# Altium schematic sheet Zigbee_broad.SchDoc
size A4
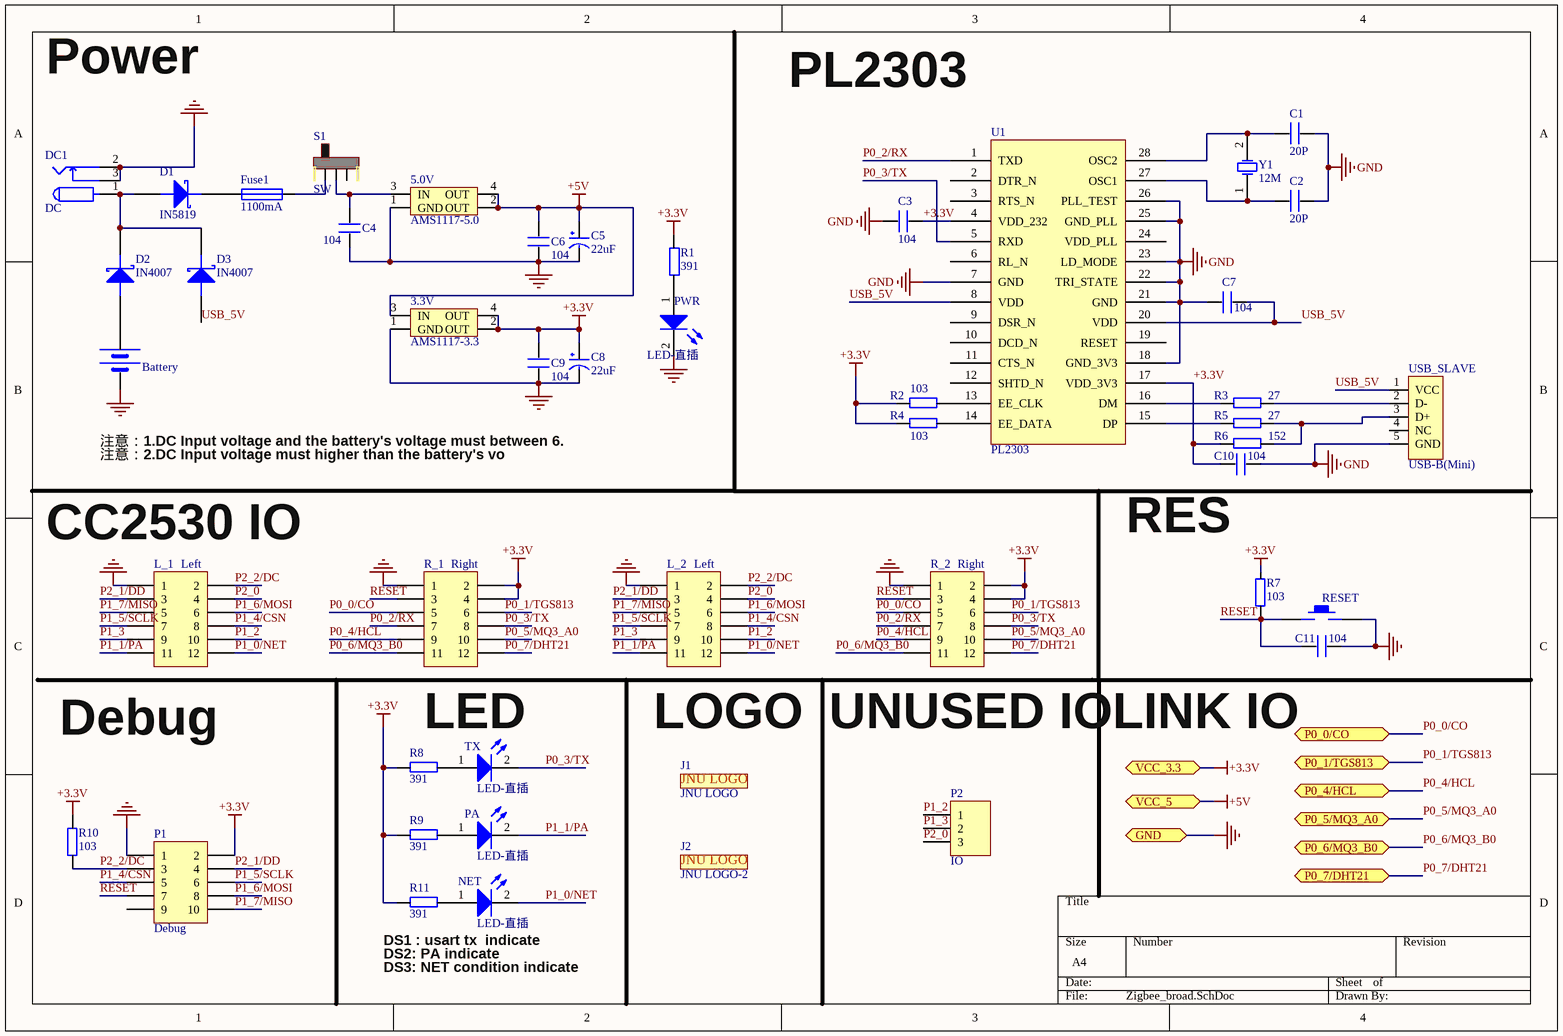
[diagram p0: Zigbee_broad.SchDoc]

## Parts
3.3V  AMS1117-3.3  [AMS1117]
5.0V  AMS1117-5.0  [AMS1117]
Battery  BATT  [DC]  (value not drawn)
C1  20P  [0603]
C2  20P  [0603]
C3  104  [0603]
C4  104  [0603]
C5  22uF  [Cap2]
C6  104  [0603]
C7  104  [0603]
C8  22uF  [Cap2]
C9  104  [0603]
C10  104  [0603]
C11  104  [0603]
D1  IN5819  [IN4007 M7]
D2  IN4007  [IN4007 M7]
D3  IN4007  [IN4007 M7]
DC1  DC  [DC]
Fuse1  1100mA  [1812]
J1  JNU LOGO  [JNU LOGO - 1]
J2  JNU LOGO-2  [JNU LOGO - 1]
L_1  Left  [HDR2X6]
L_2  Left  [HDR2X6]
NET  LED-直插  [LED]
P1  Debug  [Header 2*5]
P2  IO  [HDR1X3]
PA  LED-直插  [LED]
PWR  LED-直插  [LED]
R1  391  [0603]
R2  103  [0603]
R3  27  [0603]
R4  103  [0603]
R5  27  [0603]
R6  152  [0603]
R7  103  [0603]
R8  391  [0603]
R9  391  [0603]
R10  103  [0603]
R11  391  [0603]
R_1  Right  [HDR2X6]
R_2  Right  [HDR2X6]
RESET  KEY_M  [KEY_M]  (value not drawn)
S1  SW  [switch]
TX  LED-直插  [LED]
U1  PL2303  [PL2303 -SOP28N]
USB_SLAVE  USB-B(Mini)  [MINI_USB - 1]
Y1  12M  [XTAL]

## Ports
GND, P0_0/CO, P0_1/TGS813, P0_4/HCL, P0_5/MQ3_A0, P0_6/MQ3_B0, P0_7/DHT21, VCC_3.3, VCC_5

## Nets
+3.3V: 3.3V.2(OUT) 3.3V.4(OUT) C3.1 C8.1(VCC) C9.2 C10.2 P1.2 R1.2 R2.2 R4.2 R6.2 R7.1 R8.2 R9.2 R10.1 R11.2 R_1.2 R_1.4 R_2.2 R_2.4 U1.4(VDD_232) U1.17(VDD_3V3) ; port VCC_3.3
+5V: 3.3V.3(IN) 5.0V.2(OUT) 5.0V.4(OUT) C5.1(VCC) C6.2 ; port VCC_5
GND: 3.3V.1(GND) 5.0V.1(GND) Battery.2(GND) C1.1 C2.1 C3.2 C4.1 C5.2(GND) C6.1 C7.2 C8.2(GND) C9.1 C10.1 C11.1 DC1.2 DC1.3 L_1.1 L_2.1 P1.1 PWR.2 R_1.1 R_2.1 RESET.2 U1.7(GND) U1.18(GND_3V3) U1.21(GND) U1.22(TRI_STATE) U1.23(LD_MODE) U1.25(GND_PLL) U1.26(PLL_TEST) USB_SLAVE.5(GND) ; port GND
P0_0/CO: R_1.5 R_2.5 ; port P0_0/CO
P0_1/TGS813: R_1.6 R_2.6 ; port P0_1/TGS813
P0_2/RX: R_1.7 R_2.7 U1.1(TXD)
P0_3/TX: R_1.8 R_2.8 TX.2 U1.5(RXD)
P0_4/HCL: R_1.9 R_2.9 ; port P0_4/HCL
P0_5/MQ3_A0: R_1.10 R_2.10 ; port P0_5/MQ3_A0
P0_6/MQ3_B0: R_1.11 R_2.11 ; port P0_6/MQ3_B0
P0_7/DHT21: R_1.12 R_2.12 ; port P0_7/DHT21
P1_0/NET: L_1.12 L_2.12 NET.2
P1_1/PA: L_1.11 L_2.11 PA.2
P1_2: L_1.10 L_2.10 P2.1
P1_3: L_1.9 L_2.9 P2.2
P1_4/CSN: L_1.8 L_2.8 P1.5
P1_5/SCLK: L_1.7 L_2.7 P1.6
P1_6/MOSI: L_1.6 L_2.6 P1.8
P1_7/MISO: L_1.5 L_2.5 P1.10
P2_0: L_1.4 L_2.4 P2.3
P2_1/DD: L_1.3 L_2.3 P1.4
P2_2/DC: L_1.2 L_2.2 P1.3 R10.2
RESET: C11.2 P1.7 R7.2 R_1.3 R_2.3 RESET.1
USB_5V: C7.1 D3.1 U1.8(VDD) U1.20(VDD) USB_SLAVE.1(VCC)
Net5.0V_3: 5.0V.3(IN) C4.2 S1.2
NetBattery_1: Battery.1(VCC) D2.1
NetC1_2: C1.2 U1.28(OSC2) Y1.2(OSC2)
NetC2_2: C2.2 U1.27(OSC1) Y1.1(OSC1)
NetD1_1: D1.1 D2.2 D3.2 DC1.1
NetD1_2: D1.2 Fuse1.1
NetFuse1_2: Fuse1.2 S1.1
NetNET_1: NET.1 R11.1
NetPA_1: PA.1 R9.1
NetPWR_1: PWR.1 R1.1
NetR2_1: R2.1 U1.13(EE_CLK)
NetR3_1: R3.1 USB_SLAVE.2(D-)
NetR3_2: R3.2 U1.16(DM)
NetR4_1: R4.1 U1.14(EE_DATA)
NetR5_1: R5.1 R6.1 USB_SLAVE.3(D+)
NetR5_2: R5.2 U1.15(DP)
NetR8_1: R8.1 TX.1

Not connected (* = marked no-connect by the designer): P1 9; S1 3; U1 2(DTR_N) 3(RTS_N) 6(RL_N) 9(DSR_N) 10(DCD_N) 11(CTS_N) 12(SHTD_N) 19(RESET) 24(VDD_PLL); USB_SLAVE 4(NC)

## Notes on the sheet
- Power
- PL2303
- 注意：1.DC Input voltage and the battery's voltage must between 6.
- 注意：2.DC Input voltage must higher than the battery's vo
- (near L_1) CC2530 IO
- RES
- (near L_1) Debug
- LED
- LOGO
- (near R_2) UNUSED IO
- LINK IO
- DS1 : usart tx  indicate
- DS2: PA indicate
- DS3: NET condition indicate

## Library data of the parts
3.3V 5.0V = AMS1117: 3.3V 5V:输入6.5V-12V
Battery = BAT
C1-C4 C6 C7 C9-C11 = CAP
C5 C8 = CAP-2
D1-D3 = DIODE SCHOTTKY: Schottky Diode
Fuse1 = FUSH: 保险丝，保险丝的封装有很多，注意
J2 = JNU LOGO
L_1 L_2 R_1 R_2 = Header 6X2: Header, 6-Pin, Dual row; LatestRevisionDate: 17-Jul-2002; LatestRevisionNote: Re-released for DXP Platform.; Publisher: Altium Limited
P1 = Header 5X2: Header, 5-Pin, Dual row; LatestRevisionDate: 17-Jul-2002; LatestRevisionNote: Re-released for DXP Platform.; Publisher: Altium Limited
P2 = Header 3: Header, 3-Pin; LatestRevisionDate: 17-Jul-2002; LatestRevisionNote: Re-released for DXP Platform.; Publisher: Altium Limited
R1-R11 = Resistor
S1 = SWITC: 微拨开关
USB_SLAVE = USB_MINI
Y1 = XTAL: Crystal Oscillator; Published: 8-Jun-2000; LatestRevisionDate: 17-Jul-2002; LatestRevisionNote: Re-released for DXP Platform.; Publisher: Altium Limited